# EAGLE schematic exp 5 (EAGLE 9.6.2)
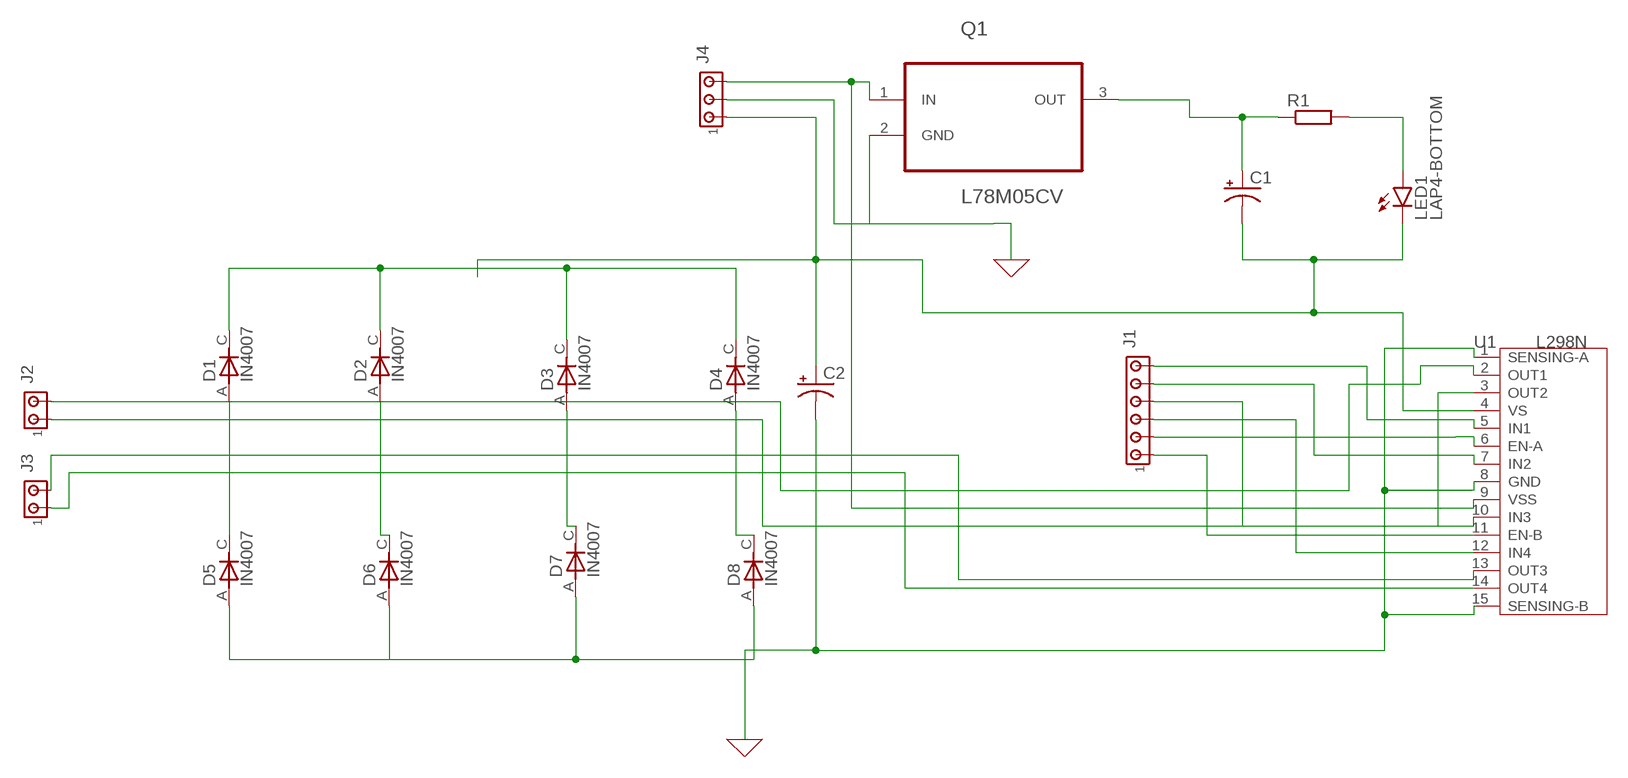
[diagram p0: schematic, sheet 1]

## Parts
C1  CPOL-US085CS-1AR  [085CS_1AR]
C2  CPOL-US085CS-1AR  [085CS_1AR]
D1  IN4007  [DIOAD1070W78L470D235P]
D2  IN4007  [DIOAD1070W78L470D235P]
D3  IN4007  [DIOAD1070W78L470D235P]
D4  IN4007  [DIOAD1070W78L470D235P]
D5  IN4007  [DIOAD1070W78L470D235P]
D6  IN4007  [DIOAD1070W78L470D235P]
D7  IN4007  [DIOAD1070W78L470D235P]
D8  IN4007  [DIOAD1070W78L470D235P]
J1  MTA06-100  [10X06MTA]
J2  MTA02-100  [10X02MTA]
J3  MTA02-100  [10X02MTA]
J4  MTA03-100  [10X03MTA]
LED1  LAP4-BOTTOM  [P47F-BOTTOM]
Q1  L78M05CV  [TO254P450X1020X1935-3P]
R1  R-EU_0204/2V  [0204V]
U1  L298N  [MULTIWATT15-V]

## Nets
0: C2.- J4.2 Q1.2(GND) U1.1(SENSING-A) U1.8(GND) U1.15(SENSING-B) ; supply symbol labelled GND
N$1: D1.C D2.C D3.C D4.C
N$2: D5.A D6.A D7.A D8.A
N$3: D1.A D5.C
N$4: D2.A D6.C
N$5: D3.A D7.C
N$6: D4.A D8.C
N$7: J3.2 U1.13(OUT3)
N$8: J2.1 U1.3(OUT2)
N$9: J3.1 U1.14(OUT4)
N$11: C1.+ Q1.3(OUT) R1.1
N$12: LED1.A R1.2
N$13: J1.2 U1.6(EN-A)
N$14: J1.1 U1.11(EN-B)
N$15: J1.4 U1.10(IN3)
N$16: J1.5 U1.7(IN2)
N$17: J1.3 U1.12(IN4)
N$18: J1.6 U1.5(IN1)
N$20: J2.2 U1.2(OUT1)
VS: C1.- C2.+ J4.1 LED1.C U1.4(VS)
VSS: J4.3 Q1.1(IN) U1.9(VSS)

## Library data of the parts
C1 C2 = rcl:CPOL-US: POLARIZED CAPACITOR, American symbol; SPICEPREFIX: C
D1-D8 = IN4007 (2):IN4007: Check availability <https://pricing.snapeda.com/parts/IN4007/Vishay%20Semiconductor/view-part?ref=eda>; AVAILABILITY: Not in stock; CHECK_PRICES: https://www.snapeda.com/parts/IN4007/Vishay/view-part/?ref=eda; DESCRIPTION: Diode Standard 1000 V 1A Through Hole DO-204AL (DO-41); MF: Vishay Semiconductor; MP: IN4007; PACKAGE: DO-41 Vishay Semiconductor; PRICE: None; SNAPEDA_LINK: https://www.snapeda.com/parts/IN4007/Vishay/view-part/?ref=snap
J1 = con-amp:MTA06-100: AMP connector Connection corrected 2014-09-19
J2 J3 = con-amp:MTA02-100: AMP connector
J4 = con-amp:MTA03-100: AMP connector
LED1 = led:*P4: PointLED® Enhanced Thinfilm LED TOP & BOTTOM mount LS P47F, LR P47F, LA P47F, LY P47F, LT P4SG, LB P4SG, LW P4SG Source: http://catalog.osram-os.com .. LA_LR_LS_LY_P47F_Pb_free.pdf
Q1 = L78M05CV:L78M05CV: Check availability <https://pricing.snapeda.com/parts/L78M05CV./STMicroelectronics/view-part?ref=eda>; AVAILABILITY: Not in stock; CHECK_PRICES: https://www.snapeda.com/parts/L78M05CV./STMicroelectronics/view-part/?ref=eda; DESCRIPTION: IC, REGULATOR +5.0V; Adjustable Output Voltage Min: -; Adjustable Output Voltage Max: -; Input Voltage Min: 7V; Input Voltage Max: 35V; Output Type: Fixed; Linear Regulator Case Style: TO-220; No. of Pins: 3Pins; Operating Temperature Min: 0°C; Operating Temperature Max: 150°C; MSL: -; SVHC: No SVHC (17-Dec-2015); Base Number: 78; Dropout Voltage Vdo: 2V; IC Generic Number: 78M05; Operating Temperature Range: 0°C to +150°C; Output Current Max: 0.5A; Output Voltage Max: 5V; Supply Voltage Max: 35V; Voltage Regulator Type: Positive Fixed; MF: STMicroelectronics; MP: L78M05CV.; PACKAGE: None; PRICE: None; SNAPEDA_LINK: https://www.snapeda.com/parts/L78M05CV./STMicroelectronics/view-part/?ref=snap
R1 = rcl:R-EU_: RESISTOR, European symbol; SPICEPREFIX: R
U1 = L298N:L298N: Check availability <https://pricing.snapeda.com/parts/L298N/4tronix/view-part?ref=eda>; AVAILABILITY: Not in stock; CHECK_PRICES: https://www.snapeda.com/parts/L298N/Netronix/view-part/?ref=eda; DESCRIPTION: 4tronix L298N Dual H-Bridge Motor Driver Module; MF: 4tronix; MP: L298N; PACKAGE: None; PRICE: None; SNAPEDA_LINK: https://www.snapeda.com/parts/L298N/Netronix/view-part/?ref=snap